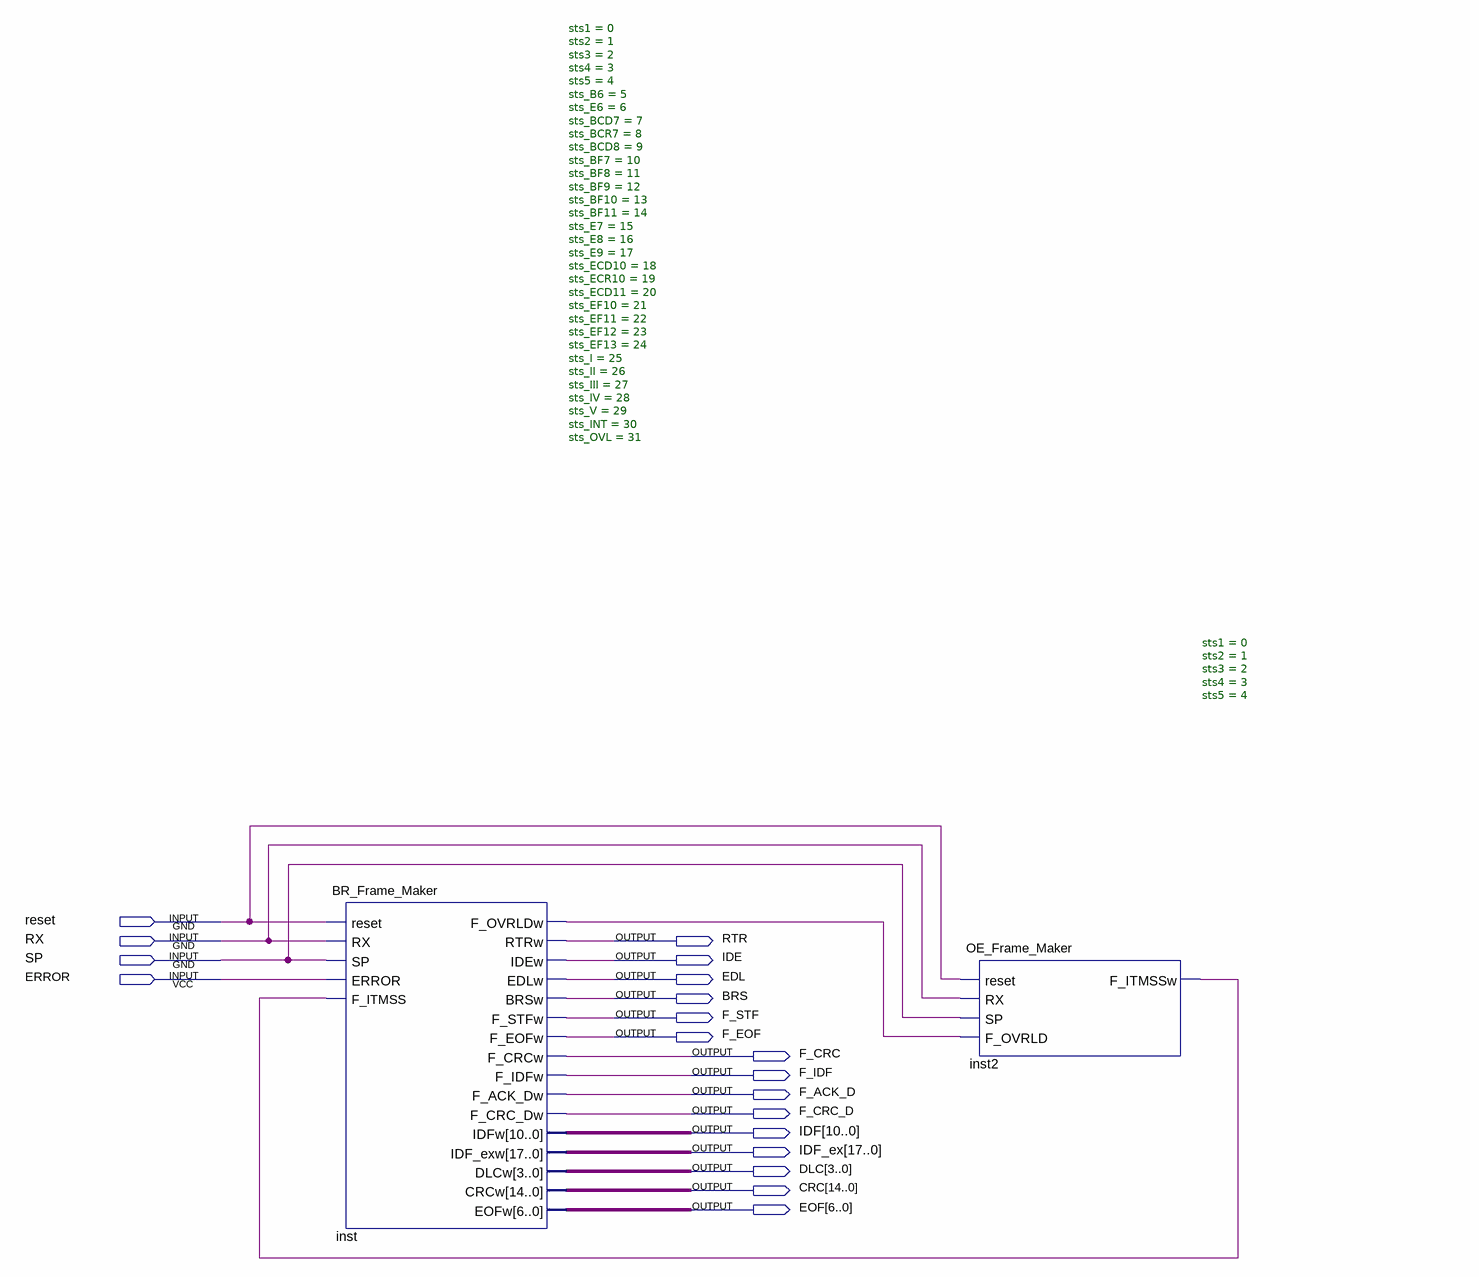
[diagram p0: schematic sheet]
// Quartus schematic Frame_Makers.bdf as structural Verilog: 2 symbols, 19 pins
module Frame_Makers (
  input  reset,
  input  RX,
  input  SP,
  input  ERROR,
  output RTR,
  output IDE,
  output EDL,
  output BRS,
  output F_STF,
  output F_EOF,
  output F_CRC,
  output F_IDF,
  output F_ACK_D,
  output F_CRC_D,
  output [10:0] IDF,
  output [17:0] IDF_ex,
  output [3:0] DLC,
  output [14:0] CRC,
  output [6:0] EOF
);

  wire inst2_f_itmssw, inst_f_ovrldw;

  BR_Frame_Maker #(.sts1(0), .sts2(1), .sts3(2), .sts4(3), .sts5(4), .sts_B6(5), .sts_E6(6), .sts_BCD7(7), .sts_BCR7(8), .sts_BCD8(9), .sts_BF7(10), .sts_BF8(11), .sts_BF9(12), .sts_BF10(13), .sts_BF11(14), .sts_E7(15), .sts_E8(16), .sts_E9(17), .sts_ECD10(18), .sts_ECR10(19), .sts_ECD11(20), .sts_EF10(21), .sts_EF11(22), .sts_EF12(23), .sts_EF13(24), .sts_I(25), .sts_II(26), .sts_III(27), .sts_IV(28), .sts_V(29), .sts_INT(30), .sts_OVL(31)) inst (
    .reset(reset), .RX(RX), .SP(SP), .ERROR(ERROR), .F_ITMSS(inst2_f_itmssw), .F_OVRLDw(inst_f_ovrldw),
    .RTRw(RTR), .IDEw(IDE), .EDLw(EDL), .BRSw(BRS), .F_STFw(F_STF), .F_EOFw(F_EOF), .F_CRCw(F_CRC),
    .F_IDFw(F_IDF), .F_ACK_Dw(F_ACK_D), .F_CRC_Dw(F_CRC_D), .IDFw(IDF), .IDF_exw(IDF_ex), .DLCw(DLC),
    .CRCw(CRC), .EOFw(EOF));
  OE_Frame_Maker #(.sts1(0), .sts2(1), .sts3(2), .sts4(3), .sts5(4)) inst2 (
    .reset(reset), .RX(RX), .SP(SP), .F_OVRLD(inst_f_ovrldw), .F_ITMSSw(inst2_f_itmssw));
endmodule
